# EasyEDA schematic SCH_Mouse-pad_2025-08-08.json
TITLE: Sheet_1; REV: 1.0; Date: 2025-08-02; Sheet: 1/1; Drawn By: mustafaali192012; Company: Your Company
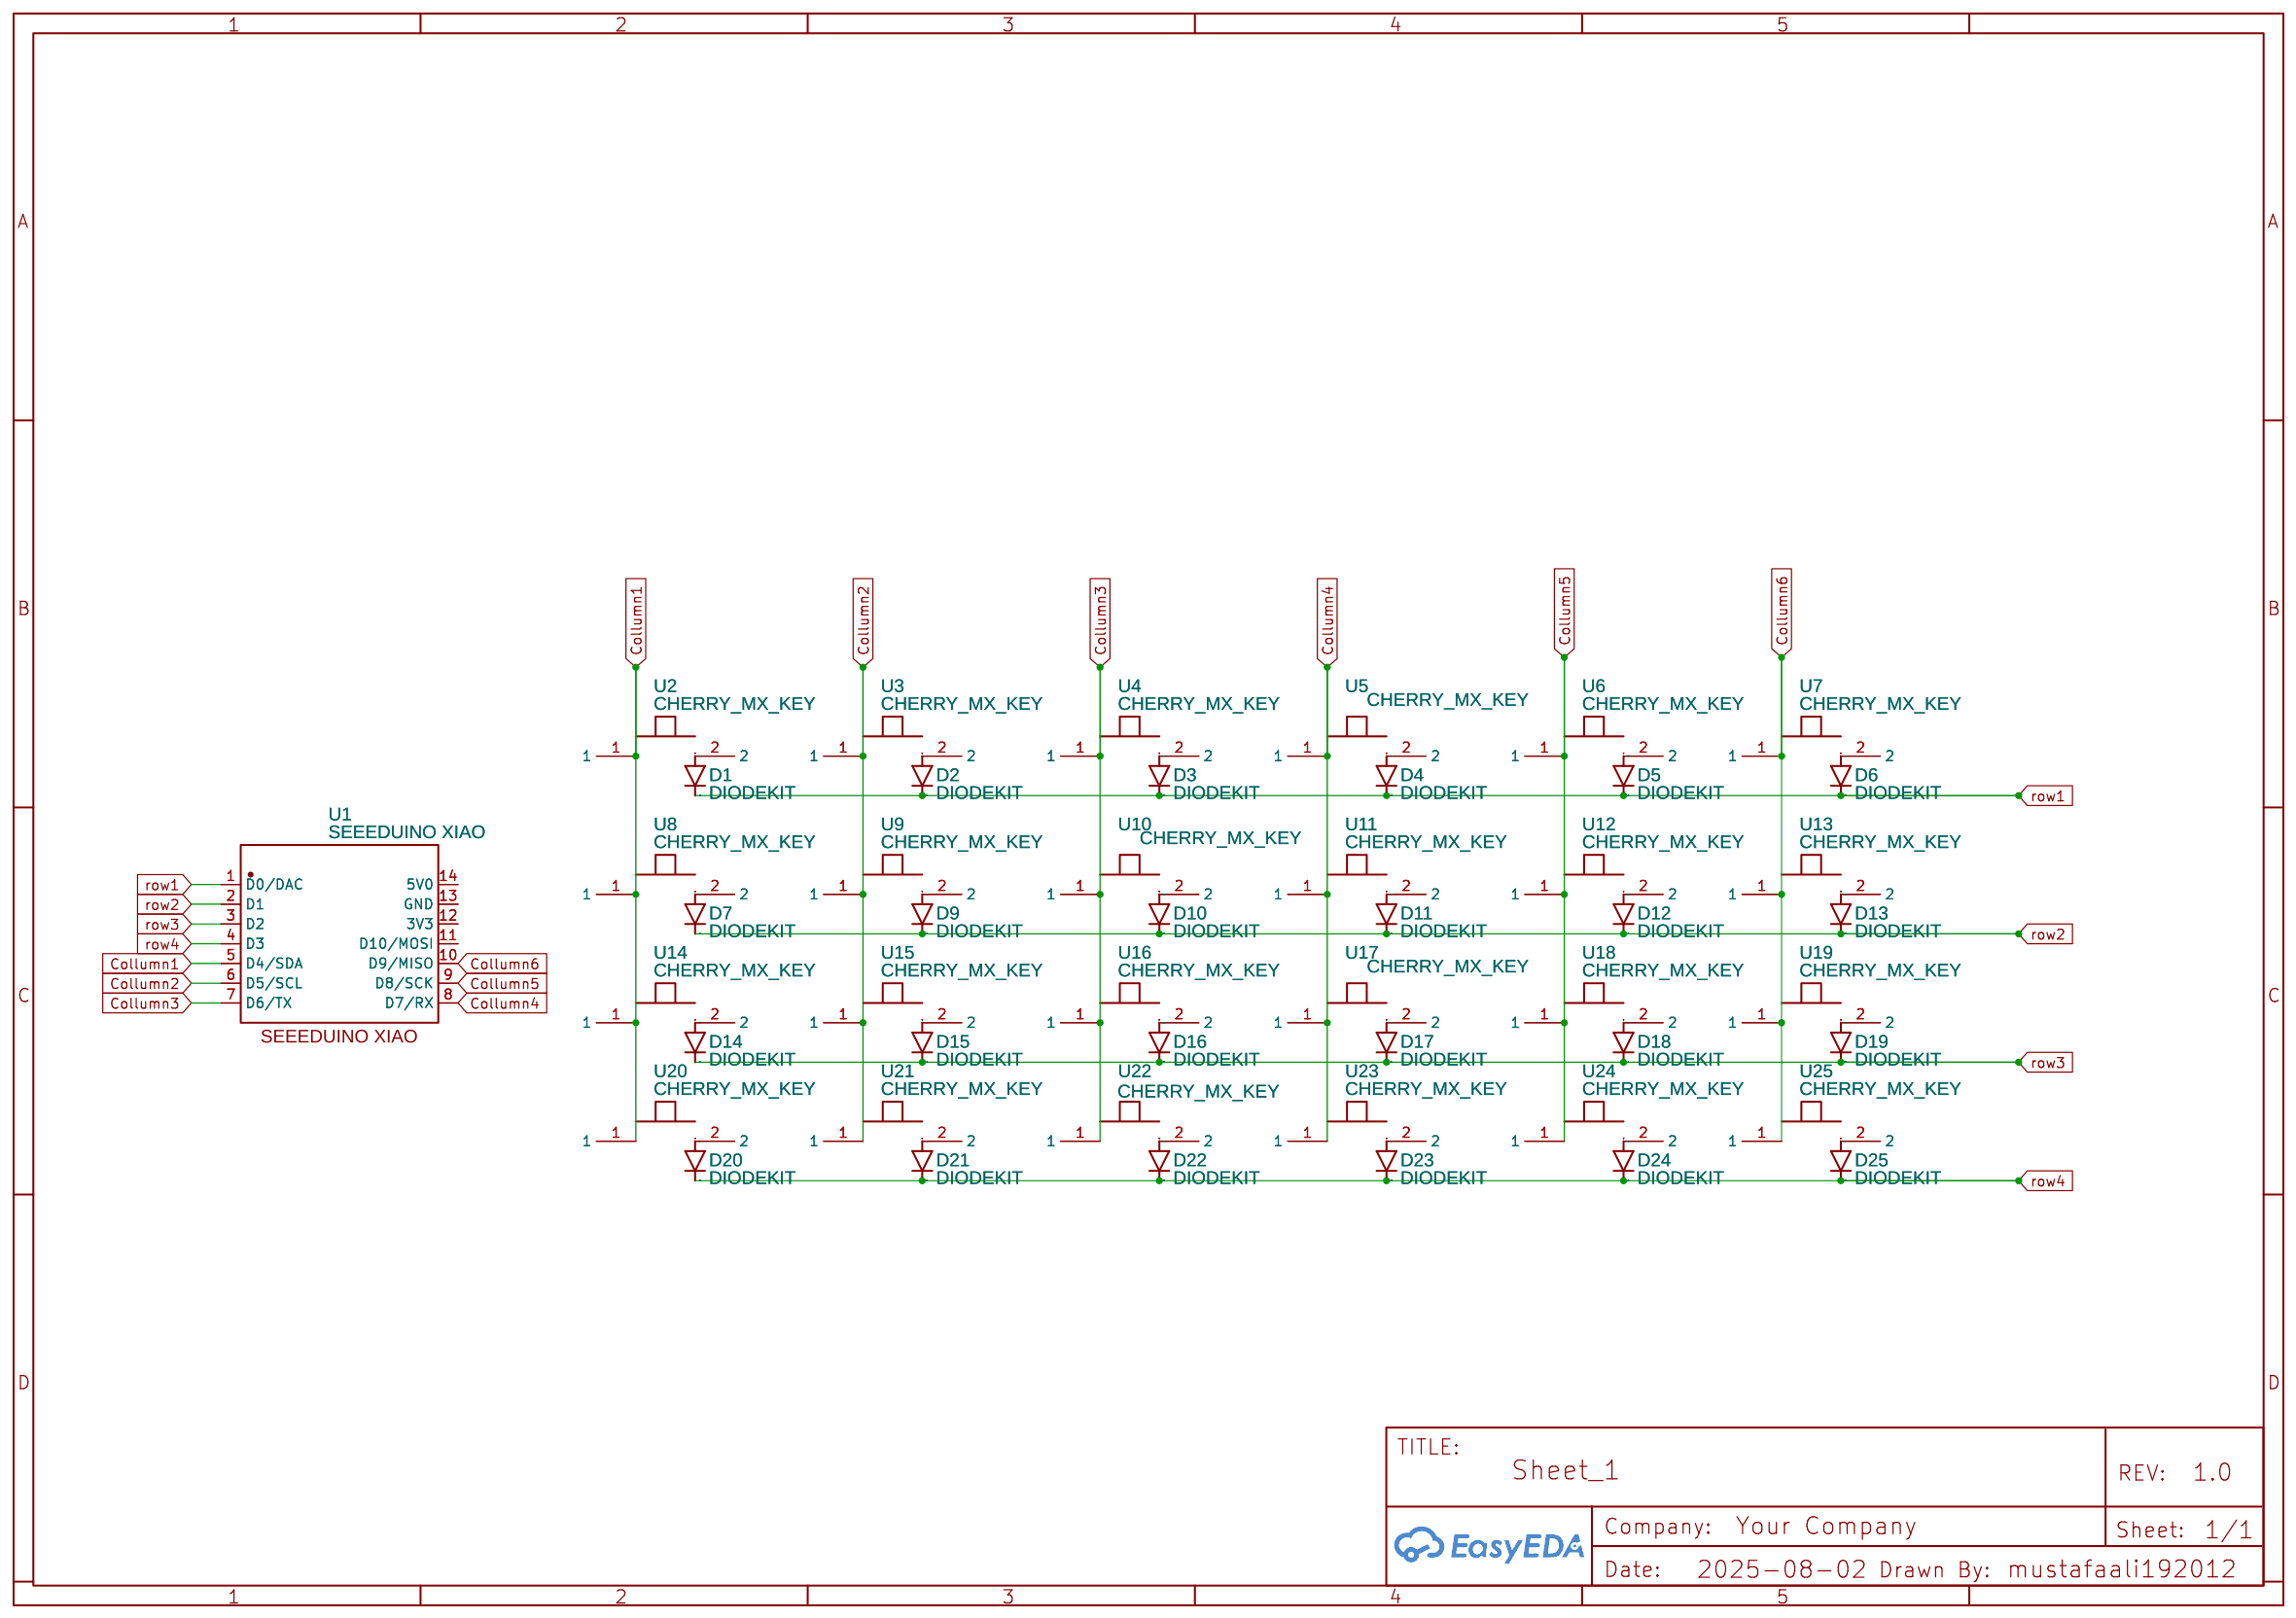
[diagram p0: schematic sheet]

## Parts
D1  DIODEKIT  [DIODE-1N4148-KIT]
D2  DIODEKIT  [DIODE-1N4148-KIT]
D3  DIODEKIT  [DIODE-1N4148-KIT]
D4  DIODEKIT  [DIODE-1N4148-KIT]
D5  DIODEKIT  [DIODE-1N4148-KIT]
D6  DIODEKIT  [DIODE-1N4148-KIT]
D7  DIODEKIT  [DIODE-1N4148-KIT]
D9  DIODEKIT  [DIODE-1N4148-KIT]
D10  DIODEKIT  [DIODE-1N4148-KIT]
D11  DIODEKIT  [DIODE-1N4148-KIT]
D12  DIODEKIT  [DIODE-1N4148-KIT]
D13  DIODEKIT  [DIODE-1N4148-KIT]
D14  DIODEKIT  [DIODE-1N4148-KIT]
D15  DIODEKIT  [DIODE-1N4148-KIT]
D16  DIODEKIT  [DIODE-1N4148-KIT]
D17  DIODEKIT  [DIODE-1N4148-KIT]
D18  DIODEKIT  [DIODE-1N4148-KIT]
D19  DIODEKIT  [DIODE-1N4148-KIT]
D20  DIODEKIT  [DIODE-1N4148-KIT]
D21  DIODEKIT  [DIODE-1N4148-KIT]
D22  DIODEKIT  [DIODE-1N4148-KIT]
D23  DIODEKIT  [DIODE-1N4148-KIT]
D24  DIODEKIT  [DIODE-1N4148-KIT]
D25  DIODEKIT  [DIODE-1N4148-KIT]
U1  SEEEDUINO XIAO  [SEEDUINO XIAO]
U2  CHERRY_MX_KEY  [MX_KEYSWITCH]
U3  CHERRY_MX_KEY  [MX_KEYSWITCH]
U4  CHERRY_MX_KEY  [MX_KEYSWITCH]
U5  CHERRY_MX_KEY  [MX_KEYSWITCH]
U6  CHERRY_MX_KEY  [MX_KEYSWITCH]
U7  CHERRY_MX_KEY  [MX_KEYSWITCH]
U8  CHERRY_MX_KEY  [MX_KEYSWITCH]
U9  CHERRY_MX_KEY  [MX_KEYSWITCH]
U10  CHERRY_MX_KEY  [MX_KEYSWITCH]
U11  CHERRY_MX_KEY  [MX_KEYSWITCH]
U12  CHERRY_MX_KEY  [MX_KEYSWITCH]
U13  CHERRY_MX_KEY  [MX_KEYSWITCH]
U14  CHERRY_MX_KEY  [MX_KEYSWITCH]
U15  CHERRY_MX_KEY  [MX_KEYSWITCH]
U16  CHERRY_MX_KEY  [MX_KEYSWITCH]
U17  CHERRY_MX_KEY  [MX_KEYSWITCH]
U18  CHERRY_MX_KEY  [MX_KEYSWITCH]
U19  CHERRY_MX_KEY  [MX_KEYSWITCH]
U20  CHERRY_MX_KEY  [MX_KEYSWITCH]
U21  CHERRY_MX_KEY  [MX_KEYSWITCH]
U22  CHERRY_MX_KEY  [MX_KEYSWITCH]
U23  CHERRY_MX_KEY  [MX_KEYSWITCH]
U24  CHERRY_MX_KEY  [MX_KEYSWITCH]
U25  CHERRY_MX_KEY  [MX_KEYSWITCH]

## Library data of the parts
D1-D7 D9-D25 = DIODEKIT: Contributor: guerwood
U1 = SEEEDUINO XIAO: Manufacturer: Seeeduino; Supplier Part: XIAO; Contributor: liangyuster
U2-U25 = CHERRY_MX_KEY: Contributor: DaveBoulden

## Nets
Collumn1: U1.5(D4/SDA) U2.1 U8.1 U14.1 U20.1
Collumn2: U1.6(D5/SCL) U3.1 U9.1 U15.1 U21.1
Collumn3: U1.7(D6/TX) U4.1 U10.1 U16.1 U22.1
Collumn4: U1.8(D7/RX) U5.1 U11.1 U17.1 U23.1
Collumn5: U1.9(D8/SCK) U6.1 U12.1 U18.1 U24.1
Collumn6: U1.10(D9/MISO) U7.1 U13.1 U19.1 U25.1
row1: D1.C D2.C D3.C D4.C D5.C D6.C U1.1(D0/DAC)
row2: D7.C D9.C D10.C D11.C D12.C D13.C U1.2(D1)
row3: D14.C D15.C D16.C D17.C D18.C D19.C U1.3(D2)
row4: D20.C D21.C D22.C D23.C D24.C D25.C U1.4(D3)
Net-(D1-A): D1.A U2.2
Net-(D2-A): D2.A U3.2
Net-(D3-A): D3.A U4.2
Net-(D4-A): D4.A U5.2
Net-(D5-A): D5.A U6.2
Net-(D6-A): D6.A U7.2
Net-(D7-A): D7.A U8.2
Net-(D9-A): D9.A U9.2
Net-(D10-A): D10.A U10.2
Net-(D11-A): D11.A U11.2
Net-(D12-A): D12.A U12.2
Net-(D13-A): D13.A U13.2
Net-(D14-A): D14.A U14.2
Net-(D15-A): D15.A U15.2
Net-(D16-A): D16.A U16.2
Net-(D17-A): D17.A U17.2
Net-(D18-A): D18.A U18.2
Net-(D19-A): D19.A U19.2
Net-(D20-A): D20.A U20.2
Net-(D21-A): D21.A U21.2
Net-(D22-A): D22.A U22.2
Net-(D23-A): D23.A U23.2
Net-(D24-A): D24.A U24.2
Net-(D25-A): D25.A U25.2

Not connected (* = marked no-connect by the designer): U1 11(D10/MOSI) 12(3V3) 13(GND) 14(5V0)
